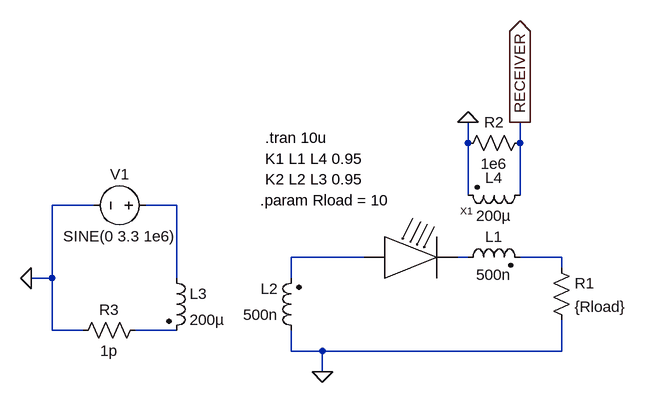
[diagram p0: schematic inductive-singleModule.asc]
inductive-singleModule.asc, the LTspice schematic file:
Version 4
SHEET 1 880 680
WIRE 288 -32 288 -64
WIRE 368 -32 368 -64
WIRE 288 48 288 -32
WIRE 368 48 368 -32
WIRE -288 64 -352 64
WIRE -160 64 -208 64
WIRE 128 144 16 144
WIRE 288 144 272 144
WIRE 432 144 368 144
WIRE 432 160 432 144
WIRE -352 176 -352 64
WIRE -352 176 -384 176
WIRE -160 176 -160 64
WIRE 16 176 16 144
WIRE -352 256 -352 176
WIRE -304 256 -352 256
WIRE -160 256 -224 256
WIRE 16 288 16 256
WIRE 64 288 16 288
WIRE 432 288 432 240
WIRE 432 288 64 288
WIRE 64 320 64 288
FLAG 288 -64 0
FLAG 368 -64 RECEIVER
IOPIN 368 -64 Out
FLAG -384 176 0
FLAG 64 320 0
SYMBOL jacModule 192 144 R0
SYMATTR InstName X1
SYMBOL res 416 144 R0
SYMATTR InstName R1
SYMATTR Value {Rload}
SYMBOL ind2 272 160 R270
WINDOW 0 32 56 VTop 2
WINDOW 3 5 56 VBottom 2
SYMATTR InstName L1
SYMATTR Value 500n
SYMATTR Type ind
SYMBOL ind2 32 272 R180
WINDOW 0 36 80 Left 2
WINDOW 3 36 40 Left 2
SYMATTR InstName L2
SYMATTR Value 500n
SYMATTR Type ind
SYMBOL ind2 -176 160 R0
SYMATTR InstName L3
SYMATTR Value 200µ
SYMATTR Type ind
SYMBOL ind2 384 32 R90
WINDOW 0 5 56 VBottom 2
WINDOW 3 32 56 VTop 2
SYMATTR InstName L4
SYMATTR Value 200µ
SYMATTR Type ind
SYMBOL voltage -192 64 R90
WINDOW 0 -32 56 VBottom 2
WINDOW 3 32 56 VTop 2
WINDOW 123 0 0 Left 2
WINDOW 39 0 0 Left 2
SYMATTR InstName V1
SYMATTR Value SINE(0 3.3 1e6)
SYMBOL res 384 -48 R90
WINDOW 0 0 56 VBottom 2
WINDOW 3 32 56 VTop 2
SYMATTR InstName R2
SYMATTR Value 1e6
SYMBOL res -208 240 R90
WINDOW 0 0 56 VBottom 2
WINDOW 3 32 56 VTop 2
SYMATTR InstName R3
SYMATTR Value 1p
TEXT -24 -40 Left 2 !.tran 10u
TEXT -24 -8 Left 2 !K1 L1 L4 0.95
TEXT -24 24 Left 2 !K2 L2 L3 0.95
TEXT -32 56 Left 2 !.param Rload = 10

The netlist it stands for:
* inductive-singleModule.asc
XX1 N002 N003 jacModule  ; pins modIN modOUT
R1 N004 0 {Rload}
L1 N003 N004 500n
L2 0 N002 500n
L3 N001 N005 200µ
L4 RECEIVER 0 200µ
V1 N001 0 SINE(0 3.3 1e6)
R2 RECEIVER 0 1e6
R3 N005 0 1p
.tran 10u
K1 L1 L4 0.95
K2 L2 L3 0.95
.param Rload = 10
.backanno
.end